# Altium schematic sheet Camera 1-2.SchDoc
size A; DrawnBy: Nick D'Ademo; DocumentNumber: 2; Revision: A; SheetNumber: 2; SheetTotal: 11
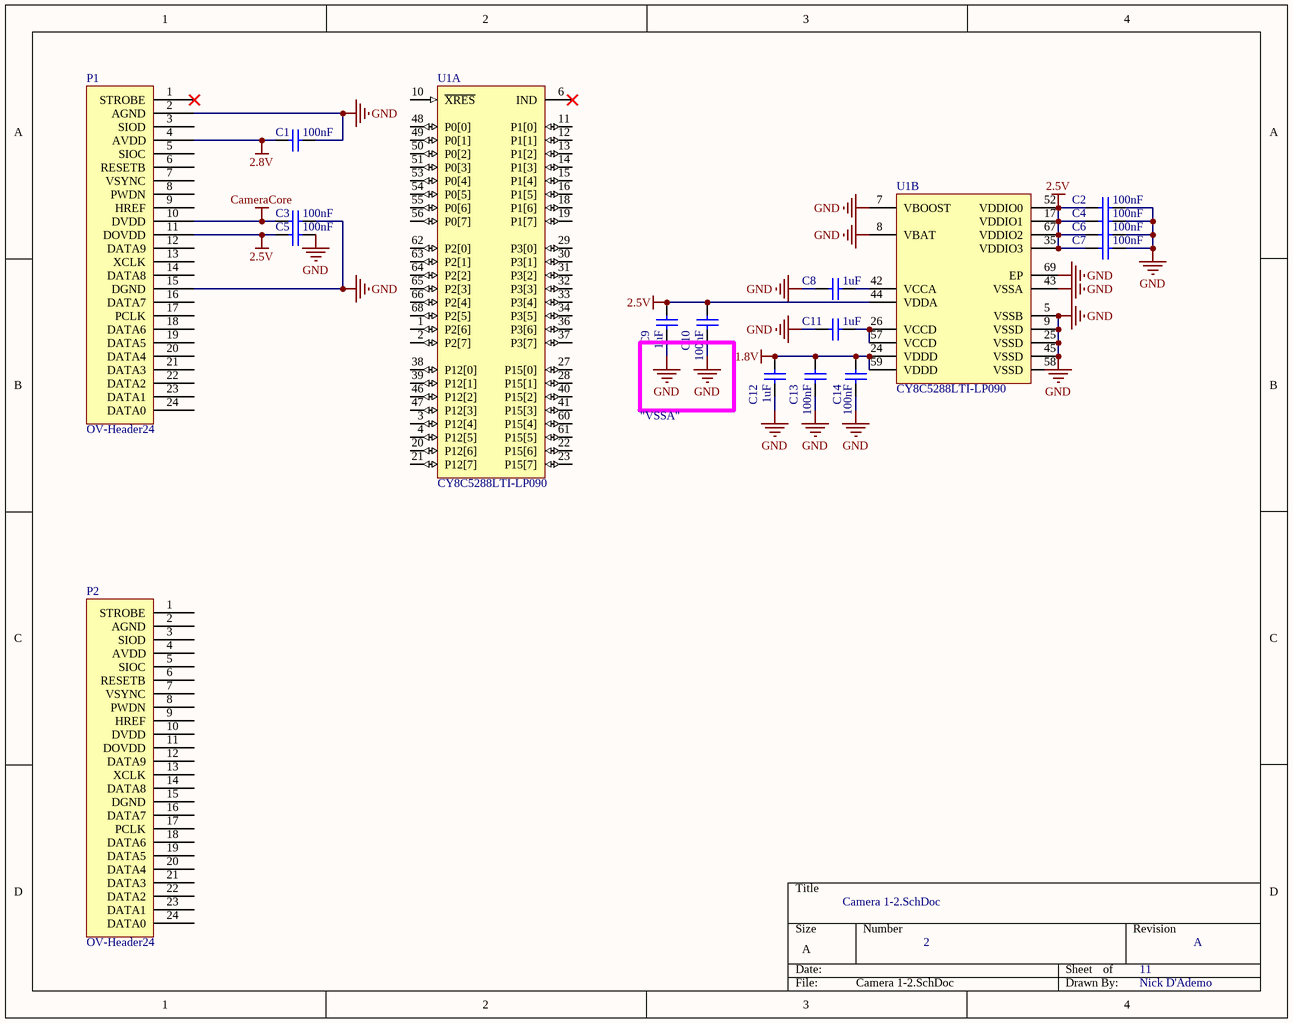
[diagram p0: Camera 1-2.SchDoc]

## Parts
C1  value 100nF  [CAPC1005N]  (hidden comment: Cap)
C2  value 100nF  [CAPC1005N]  (hidden comment: Cap)
C3  value 100nF  [CAPC1005N]  (hidden comment: Cap)
C4  value 100nF  [CAPC1005N]  (hidden comment: Cap)
C5  value 100nF  [CAPC1005N]  (hidden comment: Cap)
C6  value 100nF  [CAPC1005N]  (hidden comment: Cap)
C7  value 100nF  [CAPC1005N]  (hidden comment: Cap)
C8  value 1uF  [CAPC1005N]  (hidden comment: Cap)
C9  value 1uF  [CAPC1005N]  (hidden comment: Cap)
C10  value 100nF  [CAPC1005N]  (hidden comment: Cap)
C11  value 1uF  [CAPC1005N]  (hidden comment: Cap)
C12  value 1uF  [CAPC1005N]  (hidden comment: Cap)
C13  value 100nF  [CAPC1005N]  (hidden comment: Cap)
C14  value 100nF  [CAPC1005N]  (hidden comment: Cap)
P1  OV-Header24  [2-1734592-4_REVERSED]
P2  OV-Header24  [2-1734592-4_REVERSED]
U1  CY8C5288LTI-LP090  [CYP-LTX68_N]  (parts A,B of 2)

## Nets
1.8V: C12.2 C13.1 C14.1 U1.24(VDDD) U1.59(VDDD)
2.5V: C2.2 C4.2 C5.2 C6.2 C7.2 C9.2 C10.1 P1.11(DOVDD) U1.17(VDDIO1) U1.35(VDDIO3) U1.44(VDDA) U1.52(VDDIO0) U1.67(VDDIO2)
2.8V: C1.2 P1.4(AVDD)
CameraCore: C3.2 P1.10(DVDD)
GND: C1.1 C2.1 C3.1 C4.1 C5.1 C6.1 C7.1 C8.1 C9.1 C10.2 C11.1 C12.1 C13.2 C14.2 P1.2(AGND) P1.15(DGND) U1.5(VSSB) U1.7(VBOOST) U1.8(VBAT) U1.9(VSSD) U1.25(VSSD) U1.43(VSSA) U1.45(VSSD) U1.69(EP)
NetC8_2: C8.2 U1.42(VCCA)
NetC11_2: C11.2 U1.26(VCCD) U1.57(VCCD)

Not connected (* = marked no-connect by the designer): P1 1(STROBE)* 3(SIOD) 5(SIOC) 6(RESETB) 7(VSYNC) 8(PWDN) 9(HREF) 12(DATA9) 13(XCLK) 14(DATA8) 16(DATA7) 17(PCLK) 18(DATA6) 19(DATA5) 20(DATA4) 21(DATA3) 22(DATA2) 23(DATA1) 24(DATA0); P2 1(STROBE) 2(AGND) 3(SIOD) 4(AVDD) 5(SIOC) 6(RESETB) 7(VSYNC) 8(PWDN) 9(HREF) 10(DVDD) 11(DOVDD) 12(DATA9) 13(XCLK) 14(DATA8) 15(DGND) 16(DATA7) 17(PCLK) 18(DATA6) 19(DATA5) 20(DATA4) 21(DATA3) 22(DATA2) 23(DATA1) 24(DATA0); U1 1(P2[6]) 2(P2[7]) 3(P12[4]) 4(P12[5]) 6(IND)* 10(~{XRES}) 11(P1[0]) 12(P1[1]) 13(P1[2]) 14(P1[3]) 15(P1[4]) 16(P1[5]) 18(P1[6]) 19(P1[7]) 20(P12[6]) 21(P12[7]) 22(P15[6]) 23(P15[7]) 27(P15[0]) 28(P15[1]) 29(P3[0]) 30(P3[1]) 31(P3[2]) 32(P3[3]) 33(P3[4]) 34(P3[5]) 36(P3[6]) 37(P3[7]) 38(P12[0]) 39(P12[1]) 40(P15[2]) 41(P15[3]) 46(P12[2]) 47(P12[3]) 48(P0[0]) 49(P0[1]) 50(P0[2]) 51(P0[3]) 53(P0[4]) 54(P0[5]) 55(P0[6]) 56(P0[7]) 58(VSSD) 60(P15[4]) 61(P15[5]) 62(P2[0]) 63(P2[1]) 64(P2[2]) 65(P2[3]) 66(P2[4]) 68(P2[5])

## Notes on the sheet
- "VSSA"

## Library data of the parts
C1-C7 C10 C13 C14 = Cap: Capacitor, X7R, ±10%, 16V, 0402; Published: 8-Jun-2000; LatestRevisionDate: 17-Jul-2002; LatestRevisionNote: Re-released for DXP Platform.; PackageReference: RAD-0.3; Publisher: Altium Limited; PackageDescription: Radial Cap, Thru-Hole; 2 Leads; 0.3 in Pin Spacing
C8 C9 C11 C12 = Cap: Capacitor, X5R, ±10%, 10V, 0402; Published: 8-Jun-2000; LatestRevisionDate: 17-Jul-2002; LatestRevisionNote: Re-released for DXP Platform.; PackageReference: RAD-0.3; Publisher: Altium Limited; PackageDescription: Radial Cap, Thru-Hole; 2 Leads; 0.3 in Pin Spacing
P1 P2 = OV-Header24: TE CONNECTIVITY - 2-1734592-4 - CONN FPC BOTTOM 24POS 0.50MM R/A
U1 = CY8C5288LTI-LP089: PSoC Programmable System-on-Chip, 256 KB Flash, 38 GPIOs, 1.71 to 5.5 V, 68-Pin QFN (LTX68), Tray; Manufacturer: Cypress; CPU Core: ARM Cortex-M3; Flash (KB): 256; Max. Operating Frequency (MHz): 80; Max. Operating Voltage (V): 5.5; Min. Operating Voltage (V): 1.71; No. of GPIOs: 38; SRAM (KB): 64; DatasheetVersion: Rev. *D; PackageVersion: Rev. *E, 07/2012; PackageReference: LTX68; PackageDescription: 68-Pin Quad Flat No Lead, Body 8.00 x 8.00 mm, Pitch 0.40 mm; Max. Operating Temp. (degreesC): 85; Min. Operating Temp. (degreesC): -40; Packing: Tray; Mounting Technology: Surface Mount; Code_JEDEC: MO-220; PartNumber: CY8C5288LTI-LP089; ComponentLink1Description: Manufacturer URL; ComponentLink1URL: http://www.cypress.com/; ComponentLink2Description: Datasheet; ComponentLink2URL: http://www.cypress.com/?docID=47569; ComponentLink3Description: Package Specification; ComponentLink3URL: http://www.cypress.com/?docID=38892